# Altium project PCB_Project_LED.PrjPcb
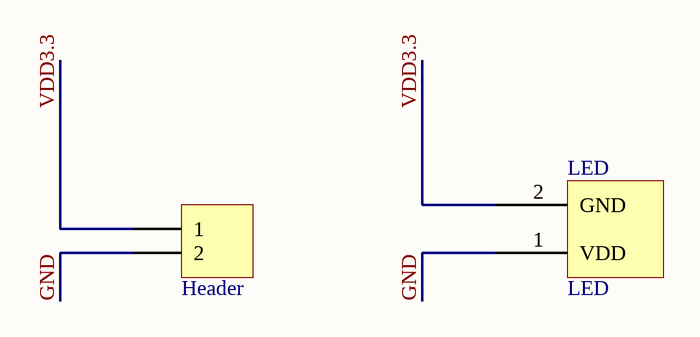
[diagram p0: LED.SchDoc]
1 sheet, 2 parts. Net scope: global (net labels, ports and power ports of the same name join across sheets).
Board files: LEDOption2.PcbDoc, LEDOption1.PcbDoc

## Sheet LED.SchDoc
size A

### Parts
LED  LED  [LED]
P9  Header  [HDR1X2]

### Nets
GND: LED.1(VDD) P9.2
VDD3.3: LED.2(GND) P9.1

### Library data of the parts
LED = Component_1
P9 = Header 2: Header, 2-Pin